# EAGLE design board (EAGLE 9.2.2)
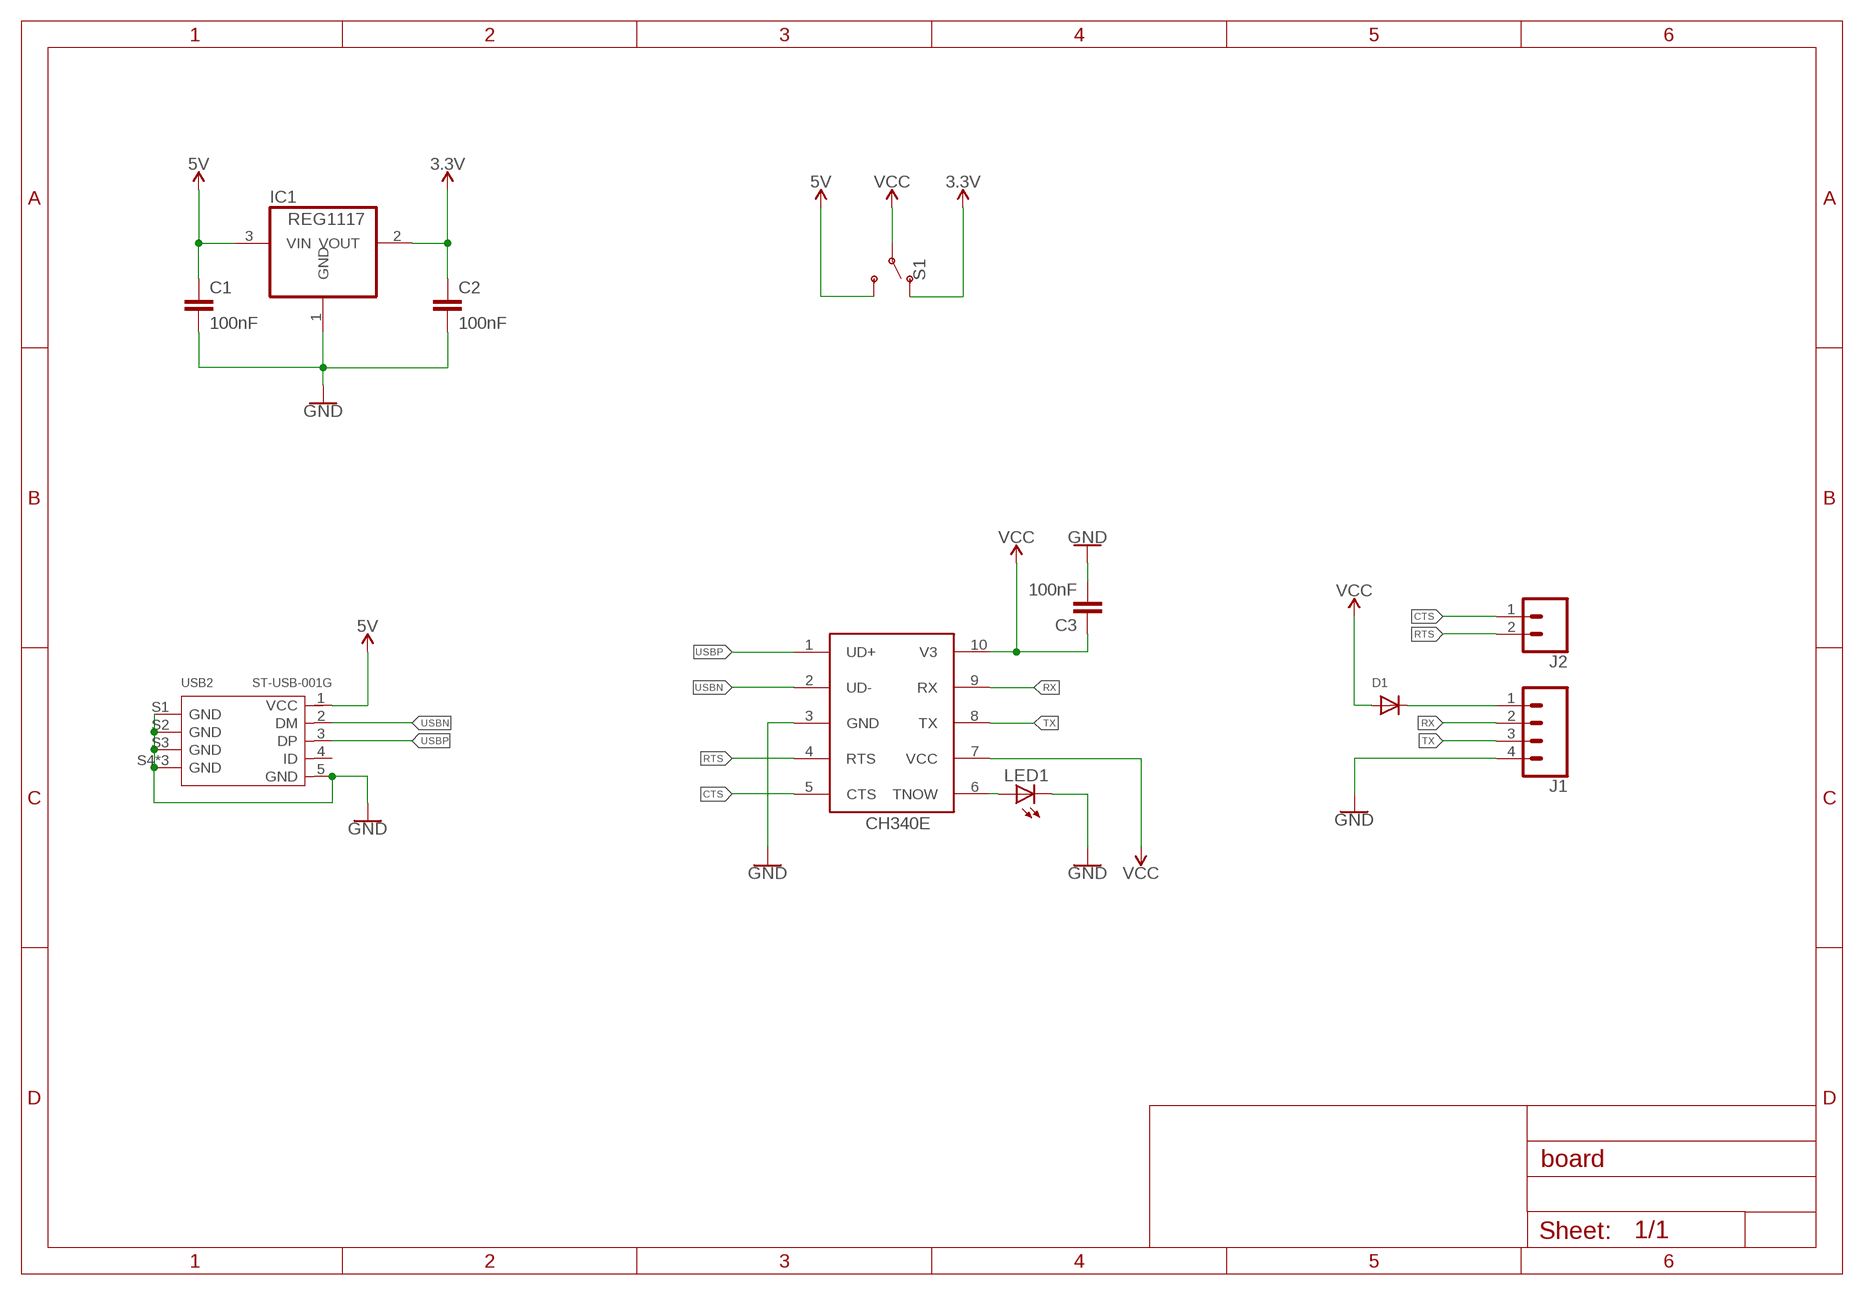
[diagram p0: schematic, sheet 1]

## Parts
C1  100nF  C-EUC0805  [C0805]
C2  100nF  C-EUC0805  [C0805]
C3  100nF  C-EUC0805  [C0805]
CH340E  CH340ESMD  [MSOP10]
D1  DIODESOD-323F  [SOD-323F]
IC1  REG1117  [SOT223]
J1  CONN_04  [1X04]
J2  CONN_02  [1X02]
LED1  LEDCHIPLED_0805  [CHIPLED_0805]
S1  SWITCH-SPDT-SMD-RIGHT-ANGLE  [SWITCH_SPST_SMD_A]
USB2  ST-USB-001G  MICRO-USB-SMD-B-WITHOUT-POST-W/P(ST-USB-001G)  [MICRO-USB5+4P-SMD-0.65-B]

## Nets
3.3V [power]: S1.1(O)
3V3 [power]: C2.1 IC1.2(VOUT) ; supply symbol labelled 3.3V
5V [power]: C1.1 IC1.3(VIN) S1.3(S) USB2.1(VCC)
CTS: CH340E.5(CTS) J2.1
GND [power]: C1.2 C2.2 C3.2 CH340E.3(GND) IC1.1(GND) J1.4 LED1.C USB2.5(GND) USB2.S1(GND) USB2.S2(GND) USB2.S3(GND) USB2.S4(GND) USB2.S5(GND) USB2.S6(GND)
N$1: CH340E.6(TNOW) LED1.A
RTS: CH340E.4(RTS) J2.2
RX: CH340E.9(RX) J1.2
TX: CH340E.8(TX) J1.3
USBN: CH340E.2(UD-) USB2.2(DM)
USBP: CH340E.1(UD+) USB2.3(DP)
VCC [power]: C3.1 CH340E.7(VCC) CH340E.10(V3) D1.A S1.2(P)
VCC_D: D1.C J1.1
Unconnected: USB2.4(ID)

## Library data of the parts
C1-C3 = rcl-2:C-EU: CAPACITOR, European symbol
CH340E = CH340E:CH340E: WCH.CN/CH340E See DataSheet： wch.cn <http://www.wch.cn/downloads/CH340DS1_PDF.html>
D1 = adafruit:DIODE: Diode SMADIODE - SMA Surface Mount Package 20V 1A Schottky Diode Digikey: 641-1014-6-ND DO-1N4148 - Through Hole Small Current Diode SOD-123 20V 1 A (.5mV Vf) Schottky Diode - Digikey: MBRX120TPMSCT-ND SOD-323 10V 570mA (.38mV Vf, 3ns) Schottky Diode - Digikey: ZLLS410CT-ND SOD-523 30V 30mA Schottky Diode (RB751S-40TE61) - Digikey: RB751S-40TE61CT-ND SOT23-R/W - SOT23 Package (R = Solder Paste/Reflow Ovens, W = Hand-Soldering) BAT54Film 40V 300mA - Digikey: 497-7162-1-ND
IC1 = burr-brown-3:REG1117: 800mA and 1A Low Dropout (LDO) Positive Regulator 1.8V, 2.5V, 2.85V, 3.3V, 5V, and Adj
J1 = SparkFun-Connectors:CONN_04: Multi connection point. Often used as Generic Header-pin footprint for 0.1 inch spaced/style header connections On any of the 0.1 inch spaced packages, you can populate with these: Break Away Headers - Straight <https://www.sparkfun.com/products/116> (PRT-00116) Break Away Male Headers - Right Angle <https://www.sparkfun.com/products/553> (PRT-00553) Female Headers <https://www.sparkfun.com/products/115> (PRT-00115) Break Away Headers - Machine Pin <https://www.sparkfun.com/products/117> (PRT-00117) Break Away Female Headers - Swiss Machine Pin <https://www.sparkfun.com/products/743> (PRT-00743) For SCREWTERMINALS and SPRING TERMINALS visit here: Screw Terimnals on SparkFun.com <https://www.sparkfun.com/search/results?term=Screw+Terminals> (5mm/3.5mm/2.54mm spacing) This device is also useful as a general connection point to wire up your design to another part of your project. Our various solder wires solder well into these plated through hole pads. Hook-Up Wire - Assortment (Stranded, 22 AWG) <https://www.sparkfun.com/products/11375> (PRT-11375) Hook-Up Wire - Assortment (Solid Core, 22 AWG) <https://www.sparkfun.com/products/11367> (PRT-11367) View the entire wire category on our website here <https://www.sparkfun.com/categories/141> Special notes: Molex polarized connector foot print use with SKU : PRT-08231 with associated crimp pins and housings. 1MM SMD Version SKU: PRT-10208; PROD_ID: CONN-09696
J2 = SparkFun-Connectors:CONN_02: Multi connection point. Often used as Generic Header-pin footprint for 0.1 inch spaced/style header connections On any of the 0.1 inch spaced packages, you can populate with these: Break Away Headers - Straight <https://www.sparkfun.com/products/116> (PRT-00116) Break Away Male Headers - Right Angle <https://www.sparkfun.com/products/553> (PRT-00553) Female Headers <https://www.sparkfun.com/products/115> (PRT-00115) Break Away Headers - Machine Pin <https://www.sparkfun.com/products/117> (PRT-00117) Break Away Female Headers - Swiss Machine Pin <https://www.sparkfun.com/products/743> (PRT-00743) For SCREWTERMINALS and SPRING TERMINALS visit here: Screw Terimnals on SparkFun.com <https://www.sparkfun.com/search/results?term=Screw+Terminals> (5mm/3.5mm/2.54mm spacing) This device is also useful as a general connection point to wire up your design to another part of your project. Our various solder wires solder well into these plated through hole pads. Hook-Up Wire - Assortment (Stranded, 22 AWG) <https://www.sparkfun.com/products/11375> (PRT-11375) Hook-Up Wire - Assortment (Solid Core, 22 AWG) <https://www.sparkfun.com/products/11367> (PRT-11367) View the entire wire category on our website here <https://www.sparkfun.com/categories/141> Special notes: Molex polarized connector foot print use with: PRT-08233 with associated crimp pins and housings. 2.54_SCREWTERM for use with PRT-10571. 3.5mm Screw Terminal footprints for PRT-08084 5mm Screw Terminal footprints for use with PRT-08432
LED1 = adafruit:LED: LED OSRAM: - CHIPLED LG R971, LG N971, LY N971, LG Q971, LY Q971, LO R971, LY R971 LH N974, LH R974 LS Q976, LO Q976, LY Q976 LO Q996 - Hyper CHIPLED LW Q18S LB Q993, LB Q99A, LB R99A - SideLED LS A670, LO A670, LY A670, LG A670, LP A670 LB A673, LV A673, LT A673, LW A673 LH A674 LY A675 LS A676, LA A676, LO A676, LY A676, LW A676 LS A679, LY A679, LG A679 - Hyper Micro SIDELED® LS Y876, LA Y876, LO Y876, LY Y876 LT Y87S - SmartLED LW L88C, LW L88S LB L89C, LB L89S, LG L890 LS L89K, LO L89K, LY L89K LS L896, LA L896, LO L896, LY L896 - TOPLED LS T670, LO T670, LY T670, LG T670, LP T670 LSG T670, LSP T670, LSY T670, LOP T670, LYG T670 LG T671, LOG T671, LSG T671 LB T673, LV T673, LT T673, LW T673 LH T674 LS T676, LA T676, LO T676, LY T676, LB T676, LH T676, LSB T676, LW T676 LB T67C, LV T67C, LT T67C, LS T67K, LO T67K, LY T67K, LW E67C LS E67B, LA E67B, LO E67B, LY E67B, LB E67C, LV E67C, LT E67C LW T67C LS T679, LY T679, LG T679 LS T770, LO T770, LY T770, LG T770, LP T770 LB T773, LV T773, LT T773, LW T773 LH T774 LS E675, LA E675, LY E675, LS T675 LS T776, LA T776, LO T776, LY T776, LB T776 LHGB T686 LT T68C, LB T68C - Hyper Mini TOPLED® LB M676 - Mini TOPLED Santana® LG M470 LS M47K, LO M47K, LY M47K Source: http://www.osram.convergy.de/
S1 = SparkFun-Switches:SWITCH-SPDT: Single Pole, Double Throw (SPDT) Switch Single-pole, double-throw (SPDT) switch. Variant Overview SMD-AYZ0202 Surface Mount DPDT Switch <https://www.sparkfun.com/products/597> (COM-00597) Used on e.g. LilyPad Arduino USB - ATmega32U4 Board <https://www.sparkfun.com/products/12049> PTH-11.6X4.0MM SPDT Mini Power Switch <https://www.sparkfun.com/products/102> (COM-00102) Used on e.g. SparkFun Simon Says - Through-Hole Soldering Kit <https://www.sparkfun.com/products/10547> (KIT-10547) PTH-11.6X4.0MM-KIT KIT version of SPDT Mini Power Switch - Simplifies soldering by removing tStop of switch pins - only one side can be soldered. PTH-11.6X4.0MM-LOCK LOCK version of SPDT Mini Power Switch - Offset pins hold switch in place for easier soldering. SMD-RIGHT-ANGLE Surface Mount Right Angle Switch <https://www.sparkfun.com/products/10860> (COM-10860) Used on e.g. SparkFun ESP8266 Thing <https://www.sparkfun.com/products/13231>; PROD_ID: SWCH-10651; SF_SKU: COM-10860
USB2 = Seeed-Connector:MICRO-USB-SMD-B-WITHOUT-POST-W/P(ST-USB-001G): 320010000; MPN: ST-USB-001G

## Net classes
0 default: width 0.203 mm
1 power: width 0.508 mm

## Board
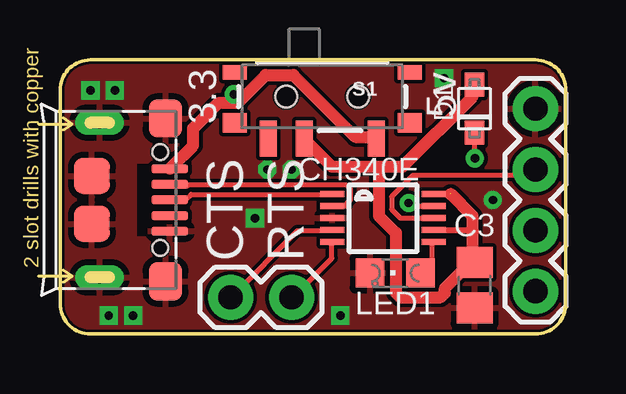
[diagram p1: board, top side]
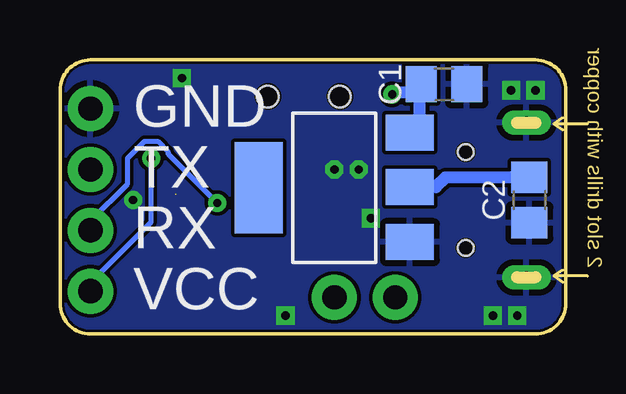
[diagram p2: board, bottom side, seen from below]

Size 21.08 x 11.43 mm. Coordinates in mm from the lower left corner, seen from the top.
Outline: 1.27,0 19.56,0 19.81,0 arc90 21.08,1.27 21.08,10.16 arc90 19.81,11.43 1.27,11.43 arc90 0,10.16 0,1.27 arc90 1.27,0
Copper layers (1*16): Top 0.035mm / dielectric 1.5mm / Bottom 0.035mm
Design rules "default *": minimum track width 6mil, minimum drill 0.35mm, track to track 6mil, track to pad 6mil, pad to pad 6mil, via to via 6mil, smd to smd 6mil, copper to edge 4mil, drill to drill 6mil, minimum pad ring 10mil, minimum via ring 8mil, stop-mask expansion 4mil, vias tented up to drill 0mil, thermal gap 10mil

### Footprints (pad centres in the part's own frame; a part is rotated, then mirrored left to right if it is on the bottom)
C0805 = smd 1.3 x 1.5: 1 -0.95,0; 2 0.95,0
MSOP10 = smd 1 x 0.25: 1 -2.113,1; 2 -2.113,0.5; 3 -2.113,0; 4 -2.113,-0.5; 5 -2.113,-1; 6 2.113,-1; 7 2.113,-0.5; 8 2.113,0; 9 2.113,0.5; 10 2.113,1
SOD-323F = smd 1 x 0.8: A -1,0; C 1,0
SOT223 = smd 1.499 x 2.007: 1 -2.261,-3.15; 2 0.025,-3.15; 3 2.311,-3.15 | smd 3.81 x 2.007: 4 0,3.15
1X04 = drill 1.016 pad 1.88: 1 0,0; 2 2.54,0; 3 5.08,0; 4 7.62,0
1X02 = drill 1.016 pad 1.88: 1 0,0; 2 2.54,0
CHIPLED_0805 = smd 1.2 x 1.2: A 0,-1.05; C 0,1.05
SWITCH_SPST_SMD_A = smd 0.7 x 1.5: 1 -2.25,-1.75; 2 -0.75,-1.75; 3 2.25,-1.75 | smd 1 x 0.6: GND1 -3.65,1; GND3 3.65,1 | smd 1 x 0.8: GND2 -3.65,-1.1; GND4 3.65,-1.1 | hole 0.9: -1.5,0; 1.5,0
MICRO-USB5+4P-SMD-0.65-B = smd 0.381 x 1.524: 1 -1.3,-0.25; 2 -0.65,-0.25; 3 0,-0.25; 4 0.65,-0.25; 5 1.3,-0.25 | smd 1.6 x 1.397: S1 -3.4,-0.427; S6 3.4,-0.427 | drill 0.508 pad 1.016 long: S2 -3.226,-3.175; S5 3.226,-3.175 | smd 1.5 x 1.5: S3 -1,-3.5; S4 1,-3.5 | hole 0.635: -2,-0.65; 2,-0.65

### Placement (x,y rotation side)
C1  5.08,10.41 0 bottom
C2  1.52,5.59 270 bottom
C3  17.27,2.03 270 top
CH340E  13.46,4.83 0 top
D1  17.27,9.4 270 top
IC1  9.65,6.1 90 bottom
J1  19.81,1.78 90 top
J2  9.65,1.52 180 top
LED1  13.97,2.54 90 top
S1  10.92,9.91 0 top
USB2  4.83,5.59 270 top

### Tracks (layer width: path | path; a pad name or v marks a point on that pad's centre or on a via)
3V3
  Bottom 0.508: C2.1 1.55,6.53 5.02,6.53 5.42,6.12 IC1.2
5V  (via drill 0.35)
  Top 0.508: 7.51,9.73 7.42,9.64 6.62,9.64 5.55,8.57 5.55,7.86 4.66,6.97 USB2.1 | 7.51,9.73 8.57,10.8 9.73,10.8 12.31,8.22 13.11,8.22 S1.3 | v7.24,10 7.51,9.73
  Bottom 0.508: IC1.3 6.44,8.48 6.08,8.84 6.08,10.35 C1.1 6.26,10.08 7.15,10.08 v7.24,10
CTS
  Top 0.203: CH340E.5 11.33,3.77 11.33,3.15 9.73,1.55 J2.1
GND  (via drill 0.35)
  other vias: 1.27,10.16 2.29,10.16 2.03,0.76 3.05,0.76 8.64,6.86 9.65,6.86 16,10.67 11.68,0.76 18.03,5.59 8.13,4.83
  pour Top: -6.1,-4.32 -6.1,16.76 27.69,16.76 27.69,-4.32
  pour Bottom: -6.1,-4.32 -6.1,16.76 27.69,16.76 27.69,-4.32
N$1
  Top 0.203: CH340E.6 15.51,3.77 15.51,2.94 LED1.A
RTS
  Top 0.203: CH340E.4 11.33,4.3 9.91,4.3 7.15,1.55 J2.2
RX  (via drill 0.35)
  Top 0.203: v14.53,5.46 14.66,5.33 CH340E.9
  Bottom 0.203: v14.53,5.46 16.57,7.51 16.57,7.59 17.02,8.04 17.55,8.04 18.26,7.33 18.26,6.26 19.77,4.75 19.77,4.39 J1.2
TX
  Top 0.203: J1.3 19.77,6.8 19.6,6.62 14.71,6.62 13.82,5.73 13.82,5.19 14.19,4.83 CH340E.8
USBN
  Top 0.203: CH340E.2 11.93,5.33 11.94,5.33 11.94,5.43 12.1,5.6 12.1,6.06 12,6.16 11.95,6.2 5.35,6.2 5.3,6.16 4.66,6.16 USB2.2
USBP
  Top 0.203: CH340E.1 11.33,5.82 5.46,5.82 5.28,5.64 4.66,5.64 USB2.3
VCC  (1 unrouted)
  Top 0.254: CH340E.7 17.19,4.33 | CH340E.10 16.24,5.83
  Top 0.508: 17.2,4.32 17.2,3.06 C3.1 17.02,2.88 16.04,1.91 16.04,1.7 15.86,1.52 14.17,1.52 14,1.7 14,4.22 13.28,4.93 13.28,6.97 | 17.2,4.32 17.2,4.93 16.3,5.83 16.28,5.83 16.27,5.83 | 13.28,6.97 11.33,6.97 10.17,8.13 S1.2 | 13.28,6.97 14.26,6.97 17.2,9.91 17.2,10.35 D1.A | 17.19,4.33 17.2,4.32
VCC_D  (via drill 0.35)
  Top 0.203: v17.29,7.33 17.29,8.39 D1.C
  Bottom 0.203: v17.29,7.33 17.29,4.66 19.77,2.17 19.77,1.82 J1.1

### Text on the board
tPlace: 3.3 | 5v | CTS | RTS
bPlace: GND | TX | RX | VCC